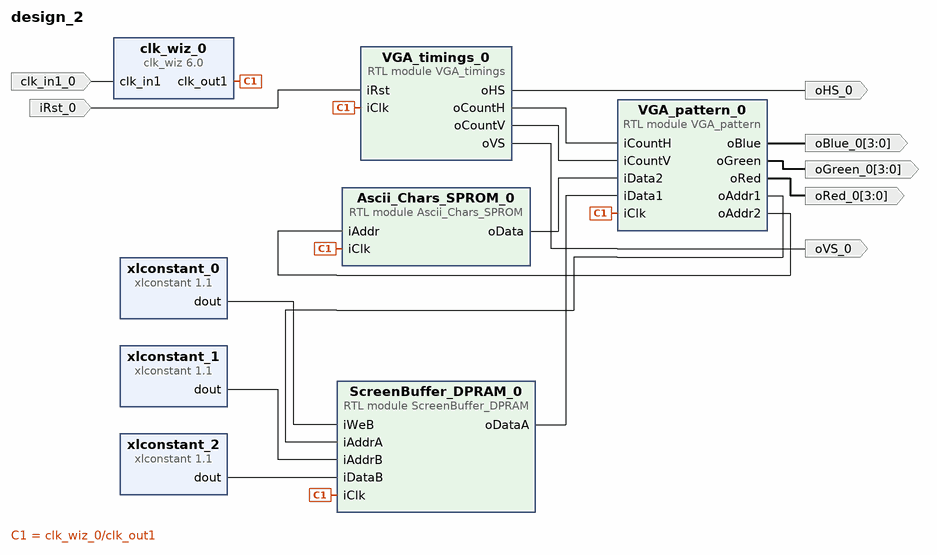
[diagram p0: block diagram of the top level]
# Vivado block design design_2, xc7z020clg400-1, Vivado 2020.1
create_bd_design design_2

create_bd_port -dir I -type clk clk_in1_0
create_bd_port -dir I iRst_0
create_bd_port -dir O -from 3 -to 0 oBlue_0
create_bd_port -dir O -from 3 -to 0 oGreen_0
create_bd_port -dir O oHS_0
create_bd_port -dir O -from 3 -to 0 oRed_0
create_bd_port -dir O oVS_0

create_bd_cell -type module -reference VGA_timings VGA_timings_0
create_bd_cell -type ip -vlnv xilinx.com:ip:clk_wiz:6.0 clk_wiz_0
set_property -dict [list \
  CONFIG.CLKIN1_JITTER_PS 80.0 \
  CONFIG.CLKOUT1_JITTER 312.659 \
  CONFIG.CLKOUT1_PHASE_ERROR 245.713 \
  CONFIG.CLKOUT1_REQUESTED_OUT_FREQ 25 \
  CONFIG.CLK_IN1_BOARD_INTERFACE sys_clock \
  CONFIG.MMCM_CLKFBOUT_MULT_F 36.500 \
  CONFIG.MMCM_CLKIN1_PERIOD 8.000 \
  CONFIG.MMCM_CLKOUT0_DIVIDE_F 36.500 \
  CONFIG.MMCM_DIVCLK_DIVIDE 5 \
] [get_bd_cells clk_wiz_0]
create_bd_cell -type ip -vlnv xilinx.com:ip:xlconstant:1.1 xlconstant_0
set_property -dict {CONFIG.CONST_VAL 0} [get_bd_cells xlconstant_0]
create_bd_cell -type ip -vlnv xilinx.com:ip:xlconstant:1.1 xlconstant_1
set_property -dict {CONFIG.CONST_VAL 0 CONFIG.CONST_WIDTH 10} [get_bd_cells xlconstant_1]
create_bd_cell -type ip -vlnv xilinx.com:ip:xlconstant:1.1 xlconstant_2
set_property -dict {CONFIG.CONST_VAL 0 CONFIG.CONST_WIDTH 12} [get_bd_cells xlconstant_2]
create_bd_cell -type module -reference Ascii_Chars_SPROM Ascii_Chars_SPROM_0
create_bd_cell -type module -reference VGA_pattern VGA_pattern_0
create_bd_cell -type module -reference ScreenBuffer_DPRAM ScreenBuffer_DPRAM_0

# ---- connections ----

connect_bd_net [get_bd_pins ScreenBuffer_DPRAM_0/oDataA] [get_bd_pins VGA_pattern_0/iData1]
connect_bd_net [get_bd_pins VGA_pattern_0/oAddr1] [get_bd_pins ScreenBuffer_DPRAM_0/iAddrA]
connect_bd_net [get_bd_pins VGA_pattern_0/oBlue] [get_bd_ports oBlue_0]
connect_bd_net [get_bd_pins VGA_pattern_0/oGreen] [get_bd_ports oGreen_0]
connect_bd_net [get_bd_pins VGA_pattern_0/oRed] [get_bd_ports oRed_0]
connect_bd_net [get_bd_pins VGA_timings_0/oCountH] [get_bd_pins VGA_pattern_0/iCountH]
connect_bd_net [get_bd_pins VGA_timings_0/oCountV] [get_bd_pins VGA_pattern_0/iCountV]
connect_bd_net [get_bd_pins VGA_timings_0/oHS] [get_bd_ports oHS_0]
connect_bd_net [get_bd_pins VGA_timings_0/oVS] [get_bd_ports oVS_0]
connect_bd_net -net clk_in1_0_1 [get_bd_ports clk_in1_0] [get_bd_pins clk_wiz_0/clk_in1]
connect_bd_net [get_bd_pins clk_wiz_0/clk_out1] \
  [get_bd_pins VGA_timings_0/iClk] [get_bd_pins Ascii_Chars_SPROM_0/iClk] [get_bd_pins VGA_pattern_0/iClk] \
  [get_bd_pins ScreenBuffer_DPRAM_0/iClk]
connect_bd_net -net iRst_0_1 [get_bd_ports iRst_0] [get_bd_pins VGA_timings_0/iRst]
connect_bd_net [get_bd_pins xlconstant_0/dout] [get_bd_pins ScreenBuffer_DPRAM_0/iWeB]
connect_bd_net [get_bd_pins xlconstant_1/dout] [get_bd_pins ScreenBuffer_DPRAM_0/iAddrB]
connect_bd_net [get_bd_pins xlconstant_2/dout] [get_bd_pins ScreenBuffer_DPRAM_0/iDataB]
connect_bd_net [get_bd_pins VGA_pattern_0/oAddr2] [get_bd_pins Ascii_Chars_SPROM_0/iAddr]
connect_bd_net [get_bd_pins Ascii_Chars_SPROM_0/oData] [get_bd_pins VGA_pattern_0/iData2]

validate_bd_design
save_bd_design
